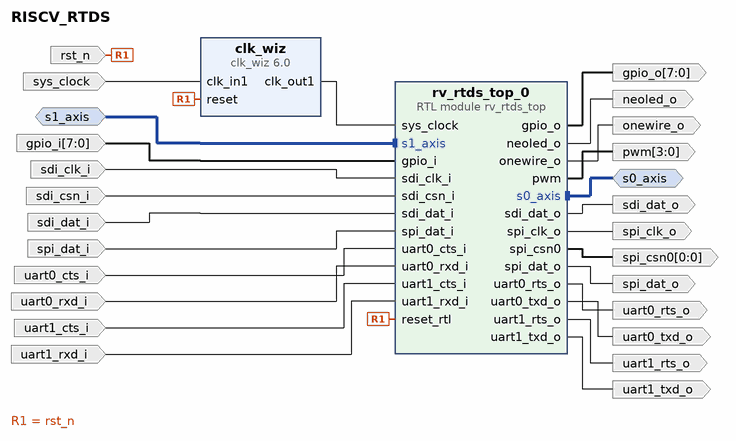
[diagram p0: block diagram of the top level]
# Vivado block design RISCV_RTDS, xc7z020clg400-1, Vivado 2023.2
create_bd_design RISCV_RTDS

create_bd_intf_port -mode Slave -vlnv xilinx.com:interface:axis_rtl:1.0 s1_axis
set_property -dict [list \
  CONFIG.HAS_TKEEP 0 \
  CONFIG.HAS_TLAST 0 \
  CONFIG.HAS_TREADY 1 \
  CONFIG.HAS_TSTRB 0 \
  CONFIG.LAYERED_METADATA undef \
  CONFIG.TDATA_NUM_BYTES 4 \
  CONFIG.TDEST_WIDTH 0 \
  CONFIG.TID_WIDTH 0 \
  CONFIG.TUSER_WIDTH 0 \
] [get_bd_intf_ports s1_axis]
create_bd_intf_port -mode Master -vlnv xilinx.com:interface:axis_rtl:1.0 s0_axis
create_bd_port -dir I -type clk sys_clock
set_property -dict {CONFIG.FREQ_HZ 125000000 CONFIG.PHASE 0.0} [get_bd_ports sys_clock]
create_bd_port -dir O -from 7 -to 0 gpio_o
create_bd_port -dir O neoled_o
create_bd_port -dir O onewire_o
create_bd_port -dir O -from 3 -to 0 pwm
create_bd_port -dir O sdi_dat_o
create_bd_port -dir O spi_clk_o
create_bd_port -dir O -from 0 -to 0 spi_csn0
create_bd_port -dir O spi_dat_o
create_bd_port -dir O uart0_rts_o
create_bd_port -dir O uart0_txd_o
create_bd_port -dir O uart1_rts_o
create_bd_port -dir O uart1_txd_o
create_bd_port -dir I uart1_rxd_i
create_bd_port -dir I uart1_cts_i
create_bd_port -dir I uart0_rxd_i
create_bd_port -dir I uart0_cts_i
create_bd_port -dir I spi_dat_i
create_bd_port -dir I sdi_dat_i
create_bd_port -dir I sdi_csn_i
create_bd_port -dir I sdi_clk_i
create_bd_port -dir I -from 7 -to 0 gpio_i
create_bd_port -dir I -type rst rst_n
set_property -dict {CONFIG.POLARITY ACTIVE_HIGH} [get_bd_ports rst_n]

create_bd_cell -type module -reference rv_rtds_top rv_rtds_top_0
create_bd_cell -type ip -vlnv xilinx.com:ip:clk_wiz:6.0 clk_wiz
set_property -dict {CONFIG.CLK_IN1_BOARD_INTERFACE sys_clock CONFIG.USE_BOARD_FLOW true} [get_bd_cells clk_wiz]

# ---- connections ----

connect_bd_intf_net [get_bd_intf_pins rv_rtds_top_0/s0_axis] [get_bd_intf_ports s0_axis]
connect_bd_intf_net [get_bd_intf_pins rv_rtds_top_0/s1_axis] [get_bd_intf_ports s1_axis]
connect_bd_net [get_bd_pins clk_wiz/clk_out1] [get_bd_pins rv_rtds_top_0/sys_clock]
connect_bd_net [get_bd_ports gpio_i] [get_bd_pins rv_rtds_top_0/gpio_i]
connect_bd_net [get_bd_ports rst_n] [get_bd_pins clk_wiz/reset] [get_bd_pins rv_rtds_top_0/reset_rtl]
connect_bd_net [get_bd_pins rv_rtds_top_0/gpio_o] [get_bd_ports gpio_o]
connect_bd_net [get_bd_pins rv_rtds_top_0/neoled_o] [get_bd_ports neoled_o]
connect_bd_net [get_bd_pins rv_rtds_top_0/onewire_o] [get_bd_ports onewire_o]
connect_bd_net [get_bd_pins rv_rtds_top_0/pwm] [get_bd_ports pwm]
connect_bd_net [get_bd_pins rv_rtds_top_0/sdi_dat_o] [get_bd_ports sdi_dat_o]
connect_bd_net [get_bd_pins rv_rtds_top_0/spi_clk_o] [get_bd_ports spi_clk_o]
connect_bd_net [get_bd_pins rv_rtds_top_0/spi_csn0] [get_bd_ports spi_csn0]
connect_bd_net [get_bd_pins rv_rtds_top_0/spi_dat_o] [get_bd_ports spi_dat_o]
connect_bd_net [get_bd_pins rv_rtds_top_0/uart0_rts_o] [get_bd_ports uart0_rts_o]
connect_bd_net [get_bd_pins rv_rtds_top_0/uart0_txd_o] [get_bd_ports uart0_txd_o]
connect_bd_net [get_bd_pins rv_rtds_top_0/uart1_rts_o] [get_bd_ports uart1_rts_o]
connect_bd_net [get_bd_pins rv_rtds_top_0/uart1_txd_o] [get_bd_ports uart1_txd_o]
connect_bd_net [get_bd_ports sdi_clk_i] [get_bd_pins rv_rtds_top_0/sdi_clk_i]
connect_bd_net [get_bd_ports sdi_csn_i] [get_bd_pins rv_rtds_top_0/sdi_csn_i]
connect_bd_net [get_bd_ports sdi_dat_i] [get_bd_pins rv_rtds_top_0/sdi_dat_i]
connect_bd_net [get_bd_ports spi_dat_i] [get_bd_pins rv_rtds_top_0/spi_dat_i]
connect_bd_net [get_bd_ports sys_clock] [get_bd_pins clk_wiz/clk_in1]
connect_bd_net [get_bd_ports uart0_cts_i] [get_bd_pins rv_rtds_top_0/uart0_cts_i]
connect_bd_net [get_bd_ports uart0_rxd_i] [get_bd_pins rv_rtds_top_0/uart0_rxd_i]
connect_bd_net [get_bd_ports uart1_cts_i] [get_bd_pins rv_rtds_top_0/uart1_cts_i]
connect_bd_net [get_bd_ports uart1_rxd_i] [get_bd_pins rv_rtds_top_0/uart1_rxd_i]

validate_bd_design
save_bd_design
